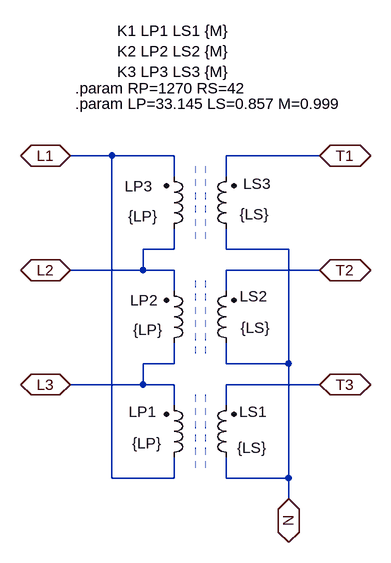
[diagram p0: schematic trafo3DY.asc]
trafo3DY.asc, the LTspice schematic file:
Version 4
SHEET 1 880 1020
WIRE 208 416 144 416
WIRE 304 416 208 416
WIRE 528 416 384 416
WIRE 304 448 304 416
WIRE 384 448 384 416
WIRE 304 560 304 528
WIRE 304 560 256 560
WIRE 384 560 384 528
WIRE 480 560 384 560
WIRE 256 592 256 560
WIRE 256 592 144 592
WIRE 304 592 256 592
WIRE 528 592 384 592
WIRE 304 624 304 592
WIRE 384 624 384 592
WIRE 304 736 304 704
WIRE 304 736 256 736
WIRE 384 736 384 704
WIRE 480 736 480 560
WIRE 480 736 384 736
WIRE 256 768 256 736
WIRE 256 768 144 768
WIRE 304 768 256 768
WIRE 528 768 384 768
WIRE 304 800 304 768
WIRE 384 800 384 768
WIRE 208 912 208 416
WIRE 304 912 304 880
WIRE 304 912 208 912
WIRE 384 912 384 880
WIRE 480 912 480 736
WIRE 480 912 384 912
WIRE 480 944 480 912
FLAG 144 768 L3
IOPIN 144 768 BiDir
FLAG 144 416 L1
IOPIN 144 416 BiDir
FLAG 528 416 T1
IOPIN 528 416 BiDir
FLAG 528 592 T2
IOPIN 528 592 BiDir
FLAG 144 592 L2
IOPIN 144 592 BiDir
FLAG 528 768 T3
IOPIN 528 768 BiDir
FLAG 480 944 N
IOPIN 480 944 BiDir
SYMBOL ind2 288 896 M180
WINDOW 0 -11 86 Right 2
WINDOW 3 -3 38 Right 2
SYMATTR InstName LP1
SYMATTR Value {LP}
SYMATTR Type ind
SYMATTR SpiceLine Rser={RP}
SYMBOL ind2 400 896 R180
WINDOW 0 -4 86 Right 2
WINDOW 3 -1 31 Right 2
SYMATTR InstName LS1
SYMATTR Value {LS}
SYMATTR Type ind
SYMATTR SpiceLine Rser={RS}
SYMBOL ind2 288 720 M180
WINDOW 0 -9 82 Right 2
WINDOW 3 -1 36 Right 2
SYMATTR InstName LP2
SYMATTR Value {LP}
SYMATTR Type ind
SYMATTR SpiceLine Rser={RP}
SYMBOL ind2 400 720 R180
WINDOW 0 -5 88 Right 2
WINDOW 3 -6 39 Right 2
SYMATTR InstName LS2
SYMATTR Value {LS}
SYMATTR Type ind
SYMATTR SpiceLine Rser={RS}
SYMBOL ind2 288 544 M180
WINDOW 0 -17 81 Right 2
WINDOW 3 -9 35 Right 2
SYMATTR InstName LP3
SYMATTR Value {LP}
SYMATTR Type ind
SYMATTR SpiceLine Rser={RP}
SYMBOL ind2 400 544 R180
WINDOW 0 -10 85 Right 2
WINDOW 3 -5 38 Right 2
SYMATTR InstName LS3
SYMATTR Value {LS}
SYMATTR Type ind
SYMATTR SpiceLine Rser={RS}
TEXT 216 224 Left 2 !K1 LP1 LS1 {M}\nK2 LP2 LS2 {M}\nK3 LP3 LS3 {M}
TEXT 152 312 Left 2 !.param RP=1270 RS=42
TEXT 152 336 Left 2 !.param LP=33.145 LS=0.857 M=0.999
LINE Normal 336 784 336 896 2
LINE Normal 352 784 352 896 2
LINE Normal 336 608 336 720 2
LINE Normal 352 608 352 720 2
LINE Normal 336 432 336 544 2
LINE Normal 352 432 352 544 2

The netlist it stands for:
* trafo3DY.asc
LP1 L1 L3 {LP} Rser={RP}
LS1 N T3 {LS} Rser={RS}
LP2 L3 L2 {LP} Rser={RP}
LS2 N T2 {LS} Rser={RS}
LP3 L2 L1 {LP} Rser={RP}
LS3 N T1 {LS} Rser={RS}
K1 LP1 LS1 {M}
K2 LP2 LS2 {M}
K3 LP3 LS3 {M}
.param RP=1270 RS=42
.param LP=33.145 LS=0.857 M=0.999
.backanno
.end